# Altium project SIM_devkit.PrjPcb
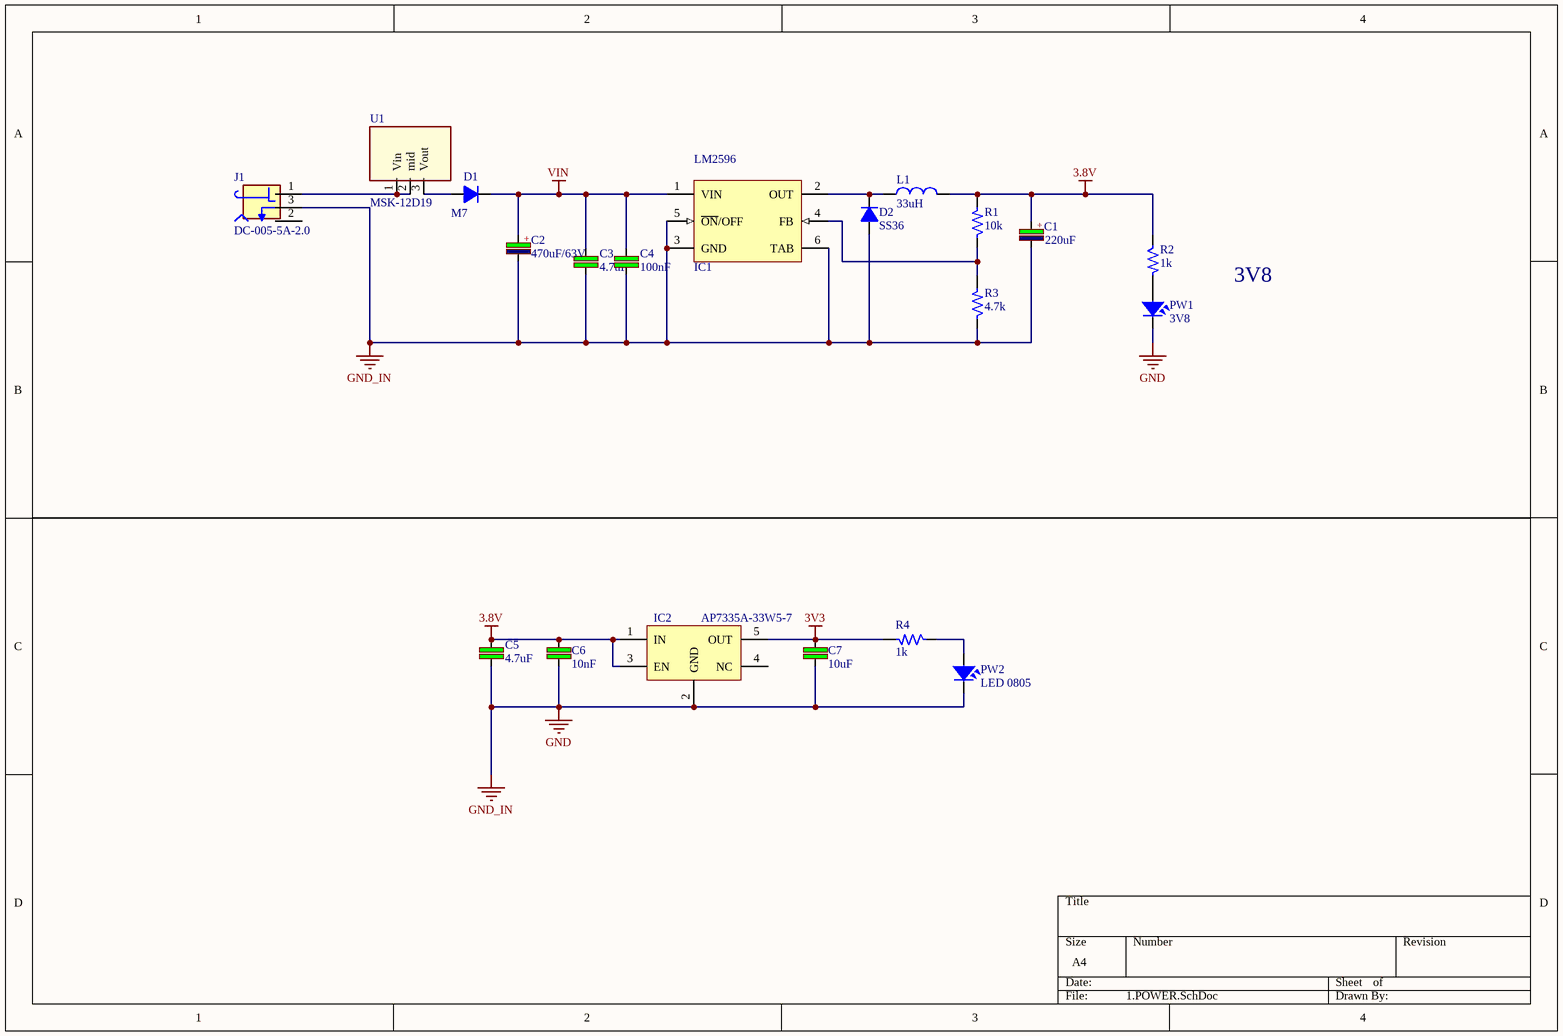
[diagram p0: 1.POWER.SchDoc]
4 sheets, 105 parts. Net scope: flat (ports and power ports of the same name join across sheets).
Board file: SIM.PcbDoc
Sheets:
  1.POWER.SchDoc
  2.4G.SchDoc
  4.STM32.SchDoc
  5.RS485.SchDoc

## Sheet 1.POWER.SchDoc
size A4; SheetNumber: 2; SheetTotal: 5

### Parts
C1  220uF  [EEFSDE]
C2  470uF/63V  [CAP-ALU-SMD-C]
C3  4.7uF  [C-0805]
C4  value 100nF  [C-0805]  (hidden comment: 4.7uF)
C5  4.7uF  [C-0805]
C6  10nF  [C-0805]
C7  10uF  [C-0805]
D1  M7  [LED-0805-Blue]
D2  SS36  [LED-0805-Blue]
IC1  LM2596  [TO-263]
IC2  AP7335A-33W5-7  [SOT23-5]
J1  DC-005-5A-2.0  [XKB_DC-005-5A-2.0]
L1  33uH  [Inductor_SMD]
PW1  3V8  [LED-0805-Blue]
PW2  LED 0805  [LED-0805-Blue]
R1  10k  [R-0805]
R2  1k  [R-0805]
R3  4.7k  [R-0805]
R4  1k  [R-0805]
U1  MSK-12D19  [Switch]

### Nets
3.8V: C1.1 C5.2 C6.1 IC2.1(IN) IC2.3(EN) L1.2 R1.2 R2.1
3V3: C7.1 IC2.5(OUT) R4.2
GND: C1.2 C2.2 C3.1 C4.1 C5.1 C6.2 C7.2 D2.1(A) IC1.3(GND) IC1.5(~{ON}/OFF) IC1.6(TAB) IC2.2(GND) J1.3 PW1.2 PW2.2 R3.1  [also labelled GND_IN]
VIN: C2.1 C3.2 C4.2 D1.2(K) IC1.1(VIN)
NetD1_1: D1.1(A) U1.3(Vout)
NetD2_2: D2.2(K) IC1.2(OUT) L1.1
NetIC1_4: IC1.4(FB) R1.1 R3.2
NetJ1_1: J1.1 U1.1(Vin) U1.2(mid)
NetPW1_1: PW1.1 R2.2
NetPW2_1: PW2.1 R4.1

Not connected (* = marked no-connect by the designer): IC2 4(NC); J1 2

### Notes on the sheet
- 3V8
- (in symbol CP3) +
- (in symbol CP5) +

### Library data of the parts
C1 = CP5: 220µF Molded Tantalum Polymer Capacitor 16V 2917 (7343 Metric) 40mOhm @ 100kHz; Manufacturer: AVX Corporation; Part number: TCME227M016R0040E; User_Description: CAP TANT POLY 220UF 16V 2917; Value: 220uF; Category: CAPACITOR; Package: 2917
C2 = CP3: Cap 470uF/63V; Value: Cap 470uF/63V
C3-C5 = C: 4.7µF ±10% 35V Ceramic Capacitor X5R 0805 (2012 Metric); Manufacturer: Samsung Electro-Mechanics; Part number: CL21A475KLCLQNC; User_Description: CAP CER 4.7UF 35V X5R 0805; Category: CAPACITOR; Package: 0805
  C3 C5: Value: 4.7uF
C6 = C: Cap SMD; Manufacturer: Samsung Electro-Mechanics; Part number: CL21A106KPFNNNG; Value: 10uF; User_Description: CAP CER 10UF 10V X5R 0805; Category: CAPACITOR; Package: 0805
C7 = C: Cap SMD; Manufacturer: Samsung Electro-Mechanics; Part number: CL21A106KPFNNNG; User_Description: CAP CER 10UF 10V X5R 0805; Value: 10uF; Category: CAPACITOR; Package: 0805
D1 = D1A: Diode 1A; Value: 1N4007
D2 = B340A: Diode Schottky 40V 3A Surface Mount DO-214AC (SMA); Manufacturer: Vishay General Semiconductor - Diodes Division; Part number: B340A-M3/61T; User_Description: DIODE SCHOTTKY 40V 3A DO214AC; Value: 40V 3A; Category: DIODE; Package: DO214AC
IC1 = LM2576
J1 = DC-005-5A-2.0: DC Power Receptacle Jack, Through Holeï¼ŒRight Angle; MF: XKB Industrial Precision; SnapEDA_Link: https://www.snapeda.com/parts/DC-005-5A-2.0/XKB+Industrial+Precision/view-part/?ref=snap; Package: Package; Value: *; MP: DC-005-5A-2.0; Check_prices: https://www.snapeda.com/parts/DC-005-5A-2.0/XKB+Industrial+Precision/view-part/?ref=eda
L1 = L1: 22µH Shielded Inductor 1.65A 96mOhm Max Nonstandard; Manufacturer: Bourns Inc.; Part Number: SRR0745A-220M; Value: 220uH; User_Description: FIXED IND 22UH 1.65A 96 MOHM SMD; Category: INDUCTORS; Package: SMD
PW1 PW2 = LED: LED RED DIFFUSED 0805 SMD; Manufacturer: OSRAM Opto Semiconductors Inc.; Part number: LS R976-NR-1; Value: Red; Category: LED SMD; Package: 0805; User_Description: LED RED DIFFUSED 0805 SMD
R1 = R: RES SMD 10K OHM 1% 1/8W 0805; Manufacturer: Yageo; Part number: RC0805FR-0710KL; Category: RESISTORS; Package: 0805; User_Description: RES SMD 10K OHM 1% 1/8W 0805; Value: 10k
R2 R4 = R: Resistor 1/4W; Manufacturer: Yageo; Part number: RC0805FR-071KL; User_Description: RES SMD 1K OHM 1% 1/8W 0805; Value: 1k; Category: RESISTORS; Package: 0805
R3 = R: RES SMD 3.3K OHM 1% 1/8W 0805; Manufacturer: Yageo; Part number: RC0805FR-073K3L; Category: RESISTORS; Package: 0805; User_Description: RES SMD 3.3K OHM 1% 1/8W 0805; Value: 3.3k
U1 = switch
IC2 = AP7335A-33W5-7: Package: SOT23-5; Part number: AP7335A-33W5-7

## Sheet 2.4G.SchDoc
size A3; SheetNumber: 3; SheetTotal: 5
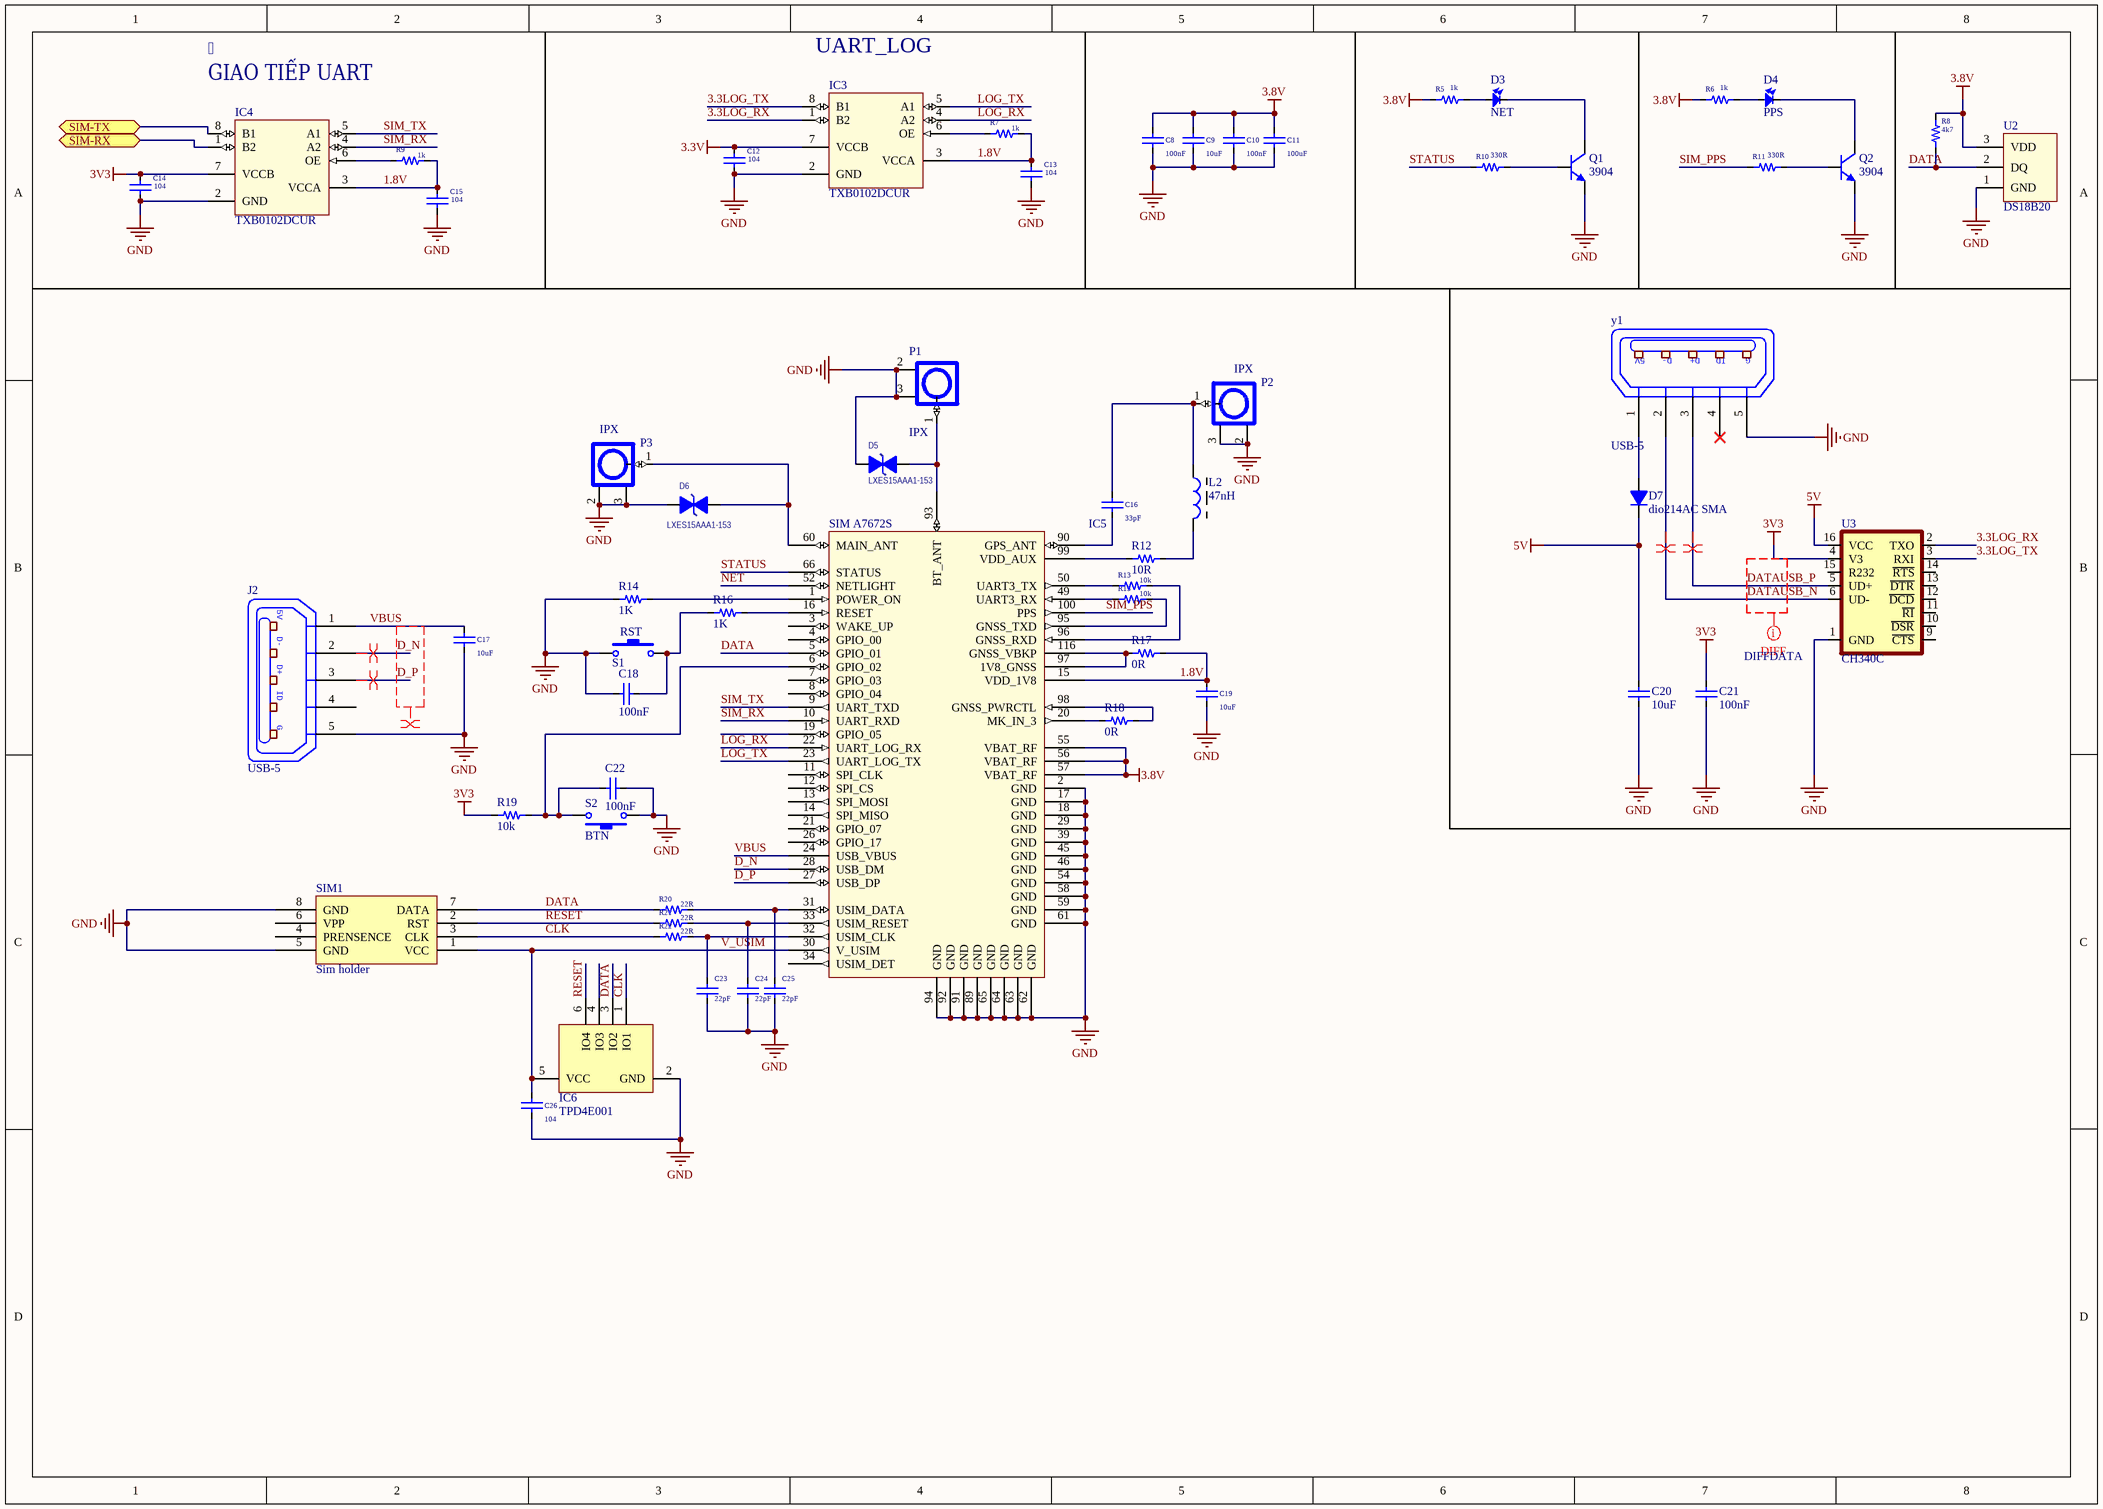
[diagram p1: 2.4G.SchDoc]

### Parts
C8  100nF  [CAP_0805]
C9  10uF  [CAP_0805]
C10  100nF  [CAP_0805]
C11  100uF  [CAP_0805]
C12  104  [CAP_0805]
C13  104  [CAP_0805]
C14  104  [CAP_0805]
C15  104  [CAP_0805]
C16  33pF  [CAP_0805]
C17  10uF  [CAP_0603]
C18  100nF  [CAP_0805]
C19  10uF  [CAP_0805]
C20  10uF  [CAP_0805]
C21  100nF  [CAP_0402]
C22  100nF  [CAP_0805]
C23  22pF  [CAP_0805]
C24  22pF  [CAP_0805]
C25  22pF  [CAP_0805]
C26  104  [CAP_0805]
D3  NET  [LED-0805-Blue]
D4  PPS  [LED-0805-Blue]
D5  LXES15AAA1-153  [INDC1005X45]
D6  LXES15AAA1-153  [INDC1005X45]
D7  dio214AC SMA  [DIO-SMD-106]
IC3  TXB0102DCUR  [SOP50P310X90-8N]
IC4  TXB0102DCUR  [SOP50P310X90-8N]
IC5  SIM A7672S  [A7672S]
IC6  TPD4E001  [SOT23-6]
J2  USB-5  [USB-M1]
L2  47nH  [Inductor_SMD]
P1  IPX  [IPXS]
P2  IPX  [IPXS]
P3  IPX  [IPXS]
Q1  3904  [MMBT3904]
Q2  3904  [MMBT3904]
R5  1k  [RES-SMD-0805]
R6  1k  [RES-SMD-0805]
R7  1k  [RES-SMD-0805]
R8  4k7  [RES-SMD-0805]
R9  1k  [RES-SMD-0805]
R10  330R  [RES-SMD-0805]
R11  330R  [RES-SMD-0805]
R12  10R  [RES-SMD-0805]
R13  10k  [RES-SMD-0805]
R14  1K  [RES-SMD-0805]
R15  10k  [RES-SMD-0805]
R16  1K  [RES-SMD-0805]
R17  0R  [RES-SMD-0805]
R18  0R  [RES-SMD-0805]
R19  10k  [RES-SMD-0805]
R20  22R  [RES-SMD-0805]
R21  22R  [RES-SMD-0805]
R22  22R  [RES-SMD-0805]
S1  RST  [SW-SMD]
S2  BTN  [SW-SMD]
SIM1  Sim holder  [SIM_MicroSIM 6P Flip]
U2  DS18B20  [QTO-92A]
U3  CH340C  [SOP-16]
y1  USB-5  [USB-M1]

### Ports
SIM-RX (bidir), SIM-TX (bidir)

### Nets
3.3V: C12.2 IC3.7(VCCB)
3.8V: C8.2 C9.2 C10.2 C11.2 IC5.55(VBAT_RF) IC5.56(VBAT_RF) IC5.57(VBAT_RF) R5.2 R6.2 R8.1 U2.3(VDD)
3V3: C14.2 C21.1 IC4.7(VCCB) R19.1 U3.4(V3)
5V: C20.1 D7.2(K) U3.16(VCC)
GND: C8.1 C9.1 C10.1 C11.1 C12.1 C13.1 C14.1 C15.1 C17.1 C18.1 C19.1 C20.2 C21.2 C22.2 C23.1 C24.1 C25.1 C26.1 D5.2(K) D6.2(K) IC3.2(GND) IC4.2(GND) IC5.2(GND) IC5.17(GND) IC5.18(GND) IC5.29(KEYPAD_0) IC5.39(GND) IC5.45(GND) IC5.46(ADC2) IC5.54(GPIO4) IC5.58(GND) IC5.59(GND) IC5.61(GND) IC5.62(GND) IC5.63(GND) IC5.64(GND) IC5.65(GND) IC5.89(GND) IC5.91(GND) IC5.92(GND) IC5.94(GND) IC6.2(GND) J2.5(P5) P1.2 P1.3 P2.2 P2.3 P3.2 P3.3 Q1.2(E) Q2.2(E) R14.1 S1.1 S2.1 SIM1.5(GND) SIM1.8(GND) U2.1(GND) U3.1(GND) y1.5(P5)
1.8V: C13.2 C15.2 C19.2 IC3.3(VCCA) IC4.3(VCCA) IC5.15(RESERVED) R7.1 R9.1 R17.2
3.3LOG_RX: IC3.1(B2) U3.2(TXO)
3.3LOG_TX: IC3.8(B1) U3.3(RXI)
CLK: IC6.1(IO1) R22.2 SIM1.3(CLK)
D_N: IC5.28(KEYSENSE_N0) J2.2(P2)
D_P: IC5.27(KEYSENSE_N1) J2.3(P3)
DATA: IC5.5(GPIO_01) IC6.3(IO2) R8.2 R20.2 SIM1.7(DATA) U2.2(DQ)
DATAUSB_N: U3.6(UD-) y1.2(P2)
DATAUSB_P: U3.5(UD+) y1.3(P3)
LOG_RX: IC3.4(A2) IC5.22(SPK_P)
LOG_TX: IC3.5(A1) IC5.23(MIC1P)
NET: IC5.52(GPIO41)
RESET: IC6.6(IO4) R21.2 SIM1.2(RST)
SIM_PPS: IC5.100(PPS) R11.2
SIM_RX: IC4.4(A2) IC5.10(UART_RXD)
SIM_TX: IC4.5(A1) IC5.9(UART_TXD)
STATUS: IC5.66(STATUS) R10.2
V_USIM: C26.2 IC5.30(KEYPAD_2) IC6.5(VCC) SIM1.1(VCC)
VBUS: C17.2 IC5.24(MIC1N) J2.1(P1)
NetC16_1: C16.1 IC5.90(GPS_ANT)
NetC16_2: C16.2 L2.1 P2.1
NetC18_2: C18.2 R16.1 S1.2
NetC22_1: C22.1 IC5.6(GPIO_02) R19.2 S2.2
NetC23_2: C23.2 IC5.32(KEYSENSE_N3) R22.1
NetC24_2: C24.2 IC5.33(KEYPAD_1) R21.1
NetC25_2: C25.2 IC5.31(KEYSENSE_N2) R20.1
NetD3_1: D3.1 R5.1
NetD3_2: D3.2 Q1.3(C)
NetD4_1: D4.1 R6.1
NetD4_2: D4.2 Q2.3(C)
NetD5_1: D5.1(A) IC5.93(BT_ANT) P1.1
NetD6_1: D6.1(A) IC5.60(MAIN_ANT) P3.1
NetD7_1: D7.1(A) y1.1(P1)
NetIC3_6: IC3.6(OE) R7.2
NetIC4_1: IC4.1(B2) ; port SIM-RX
NetIC4_6: IC4.6(OE) R9.2
NetIC4_8: IC4.8(B1) ; port SIM-TX
NetIC5_1: IC5.1(POWER_ON) R14.2
NetIC5_16: IC5.16(RESERVED) R16.2
NetIC5_20: IC5.20(MK_IN_3) R18.1
NetIC5_49: IC5.49(GPIO40) R15.2
NetIC5_50: IC5.50(GPIO43) R13.2
NetIC5_95: IC5.95(GNSS_TXD) R15.1
NetIC5_96: IC5.96(GNSS_RXD) R13.1
NetIC5_97: IC5.97(1V8_GNSS) IC5.116(GNSS_VBKP) R17.1
NetIC5_98: IC5.98(GNSS_PWRCTL) R18.2
NetIC5_99: IC5.99(VDD_AUX) R12.1
NetL2_2: L2.2 R12.2
NetQ1_1: Q1.1(B) R10.1
NetQ2_1: Q2.1(B) R11.1

Not connected (* = marked no-connect by the designer): IC5 3(WAKE_UP) 4(GPIO_00) 7(GPIO_03) 8(GPIO_04) 11(SPI_CLK) 12(SPI_CS) 13(SPI_MOSI) 14(SPI_MISO) 19(GPIO_05) 21(SPK_M) 25(EAR1N) 26(EAR1P) 34(KEYPAD_4) 35(KEYPAD_3) 36(KEYSENSE_N4) 47(ADC1) 48(GPIO44) 51(GPIO1) 53(GPIO42) 73(PCM_DOUT) 74(PCM_DIN) 75(PCM_SYNC) 76(PCM_CLK); IC6 4(IO3); J2 4(P4); SIM1 4(PRENSENCE) 6(VPP); U3 9(~{CTS}) 10(~{DSR}) 11(~{RI}) 12(~{DCD}) 13(~{DTR}) 14(~{RTS}) 15(R232); y1 4(P4)*

### Layout directives
net class DIFFDATA: DATAUSB_N, DATAUSB_P
differential pair; net class DIFFDATA: D_N, D_P, DATAUSB_N, DATAUSB_P

### Notes on the sheet
- 
- (near IC4) GIAO TIẾP UART
- (near IC3) UART_LOG
- (in symbol USB-5) 5V; D-; D+; ID; G

### Library data of the parts
C8-C26 = CapSMD: Capacitor; Value: 33p; Published: 8-Jun-2000; LatestRevisionDate: 17-Jul-2002; LatestRevisionNote: Re-released for DXP Platform.; PackageReference: RAD-0.3; Publisher: Altium Limited
D3 D4 = LED: LED Single colour Green and Red; Value: LED 3 ly Single Colour
D5 D6 = TVS: TVS DIODE 4VWM 1005; Manufacturer: Murata Electronics; Value: 4V; Category: Circuit Protection; Package: 0402; Part number: LXES15AAA1-153; User_Description: TVS DIODE 4VWM 1005
D7 = D1A: Diode 1A; Value: 1N4007
IC3 IC4 = TXB0102DCUR: IC TRNSLTR BIDIRECTIONAL US8; Manufacturer: Texas Instruments; Category: IC Logic Level; Package: 8-VSSOP; Part number: TXB0102DCUR; User_Description: IC TRNSLTR BIDIRECTIONAL US8
IC5 = SIM A7672S: SIM A7672S-CAT-M1; Part number: SIM A7672S
IC6 = TPD4E001_1: Manufacturer: Texas Instruments; Part number: TPD4E001RDBVR; User_Description: TVS DIODE 5.5VWM SC70-6; Category: Circuit Protection; Package: SOT-363
J2 y1 = USB-5: Manufacturer: FCI; Category: Connectors, Interconnects
L2 = Inductor Ferit: FIXED IND 47NH 300MA 700MOHM SMD; Manufacturer: Taiyo Yuden; Part number: HK160847NJ-T; Value: 150 mH; Category: INDUCTORS; Package: 0603; User_Description: FIXED IND 47NH 300MA 700MOHM SMD
P1-P3 = IPXSx66: Antenna GSM GPS; Manufacturer: TE Connectivity AMP Connectors; Part number: 2334884-1; User_Description: UMCC MICRO-COAX RECEPTACLE, GEN; Category: Connectors; Package: SMD
Q1 Q2 = MMBT3904
R5-R22 = Resistor - SMD: Resistor; Manufacturer: Generic Components; Class: Passive; Published: 08/06/2000; Publisher: Altium Hobart Technology Centre
S1 S2 = SW-SMD: Switch; Published: 24-Mar-1999; LatestRevisionDate: 17-Jul-2002; LatestRevisionNote: Re-released for DXP Platform.; PackageReference: SPST-2; Publisher: Altium Limited
SIM1 = SIM_MicroSim
U2 = DS18B20: High Precision  1-Wire® Digital Thermometer
U3 = CH340C: USB to serial chip CH340; MF: WCH; Package: Package; Check_prices: https://www.snapeda.com/parts/CH340C/WCH/view-part/5428851/?ref=eda; Value: *; Price: None; MP: CH340C; Availability: Unavailable; SnapEDA_Link: https://www.snapeda.com/parts/CH340C/WCH/view-part/5428851/?ref=snap

## Sheet 4.STM32.SchDoc
size A3; SheetNumber: 4; SheetTotal: 5
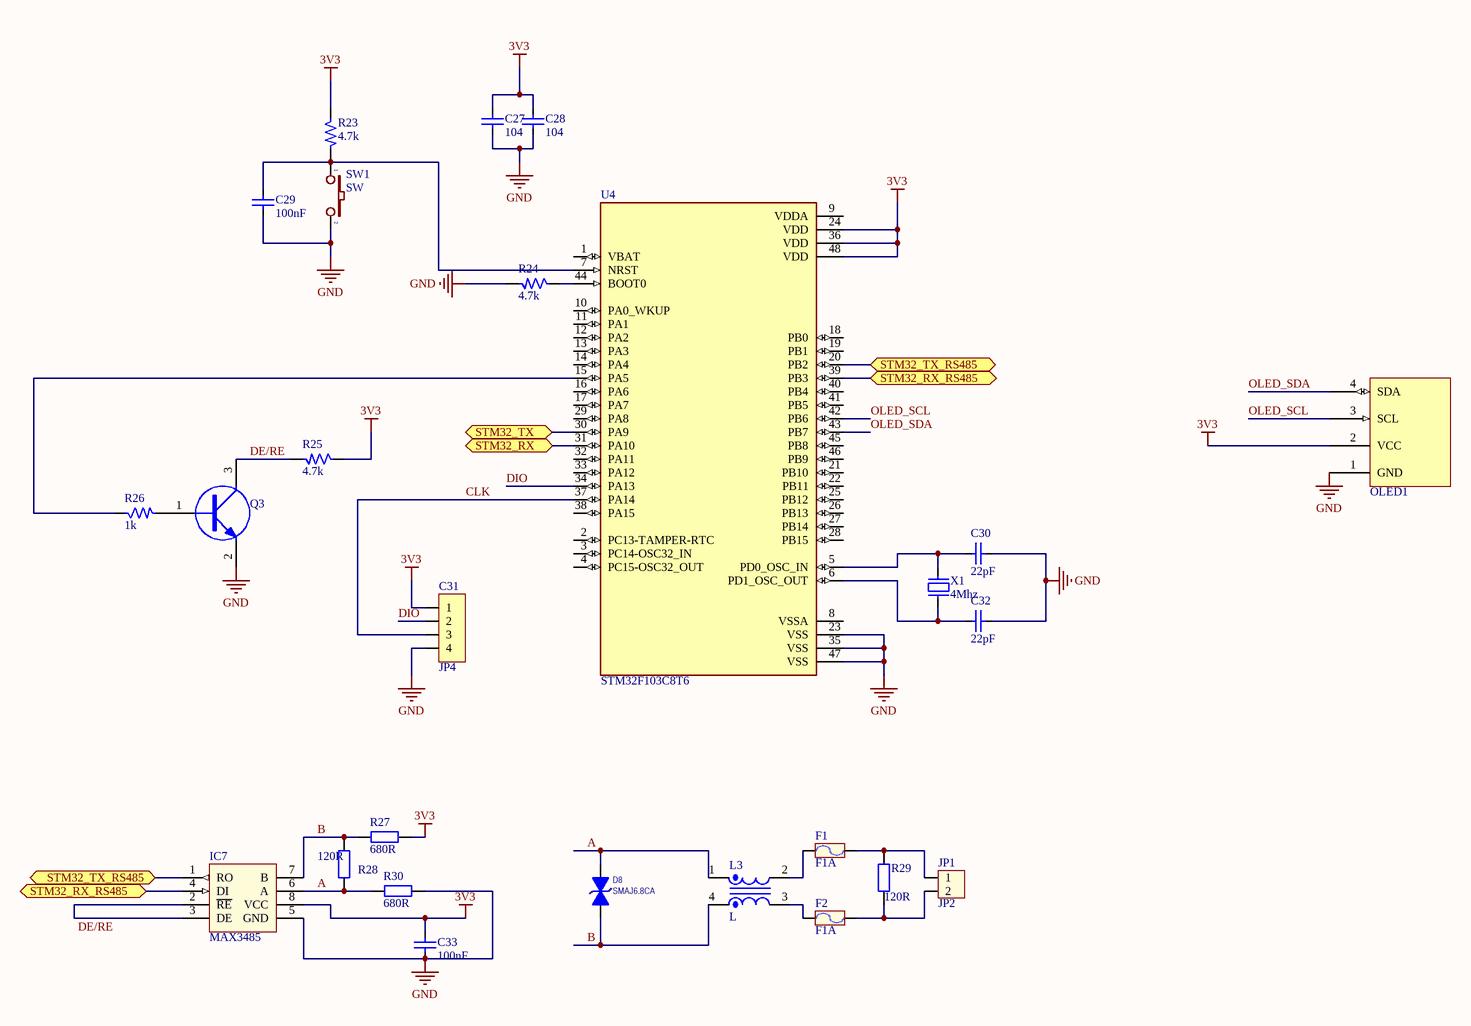
[diagram p2: 4.STM32.SchDoc]

### Parts
C27  104  [CAP_0805]
C28  104  [CAP_0805]
C29  100nF  [CAP_0805]
C30  22pF  [CAP_0805]
C31  JP4  [JP4-C1T]
C32  22pF  [CAP_0805]
C33  100nF  [CAP_0805]
D8  SMAJ6.8CA  [SOD323 - DO241]
F1  F1A  [RES-SMD-1206]
F2  F1A  [RES-SMD-1206]
IC7  MAX3485  [SOIC-8]
JP1  JP2  [KF2-5.08]
L3  L  [L-B82793S0513N201]
OLED1  SSD1306  [OLED 1.3]  (value not drawn)
Q3  C1815(MMBT4401)  [SOT23]  (value not drawn)
R23  4.7k  [R-0805]
R24  4.7k  [R-0805]
R25  4.7k  [R-0805]
R26  1k  [R-0805]
R27  680R  [RES-SMD-0805]
R28  120R  [RES-SMD-0805]
R29  120R  [RES-SMD-0805]
R30  680R  [RES-SMD-0805]
SW1  SW  [SW2]
U4  STM32F103C8T6  [STM32F103C8T6]
X1  4Mhz  [XT2]

### Ports
STM32_RX (bidir), STM32_RX_RS485 (bidir), STM32_TX (bidir), STM32_TX_RS485 (bidir)

### Nets
3V3: C27.1 C28.1 C31.1 C33.1 IC7.8(VCC) OLED1.2(VCC) R23.1 R25.1 R27.2 U4.24(VDD) U4.36(VDD) U4.48(VDD)
GND: C27.2 C28.2 C29.2 C30.1 C31.4 C32.1 C33.2 IC7.5(GND) OLED1.1(GND) Q3.2(E) R24.2 R30.2 SW1.2 U4.23(VSS) U4.35(VSS) U4.47(VSS)
A: D8.2(K) IC7.6(A) L3.1 R28.2 R30.1
B: D8.1(A) IC7.7(B) L3.4 R27.1 R28.1
CLK: C31.3 U4.37(PA14)
DE/RE: IC7.2(~{RE}) IC7.3(DE) Q3.3(C) R25.2
DIO: C31.2 U4.34(PA13)
OLED_SCL: OLED1.3(SCL) U4.42(PB6)
OLED_SDA: OLED1.4(SDA) U4.43(PB7)
NetC29_1: C29.1 R23.2 SW1.1 U4.7(NRST)
NetC30_2: C30.2 U4.5(PD0_OSC_IN) X1.2
NetC32_2: C32.2 U4.6(PD1_OSC_OUT) X1.1
NetF1_1: F1.1 L3.2
NetF1_2: F1.2 JP1.1 R29.1
NetF2_1: F2.1 L3.3
NetF2_2: F2.2 JP1.2 R29.2
NetIC7_1: IC7.1(RO) U4.20(PB2) ; port STM32_TX_RS485
NetIC7_4: IC7.4(DI) U4.39(PB3) ; port STM32_RX_RS485
NetQ3_1: Q3.1(B) R26.2
NetR24_1: R24.1 U4.44(BOOT0)
NetR26_1: R26.1 U4.15(PA5)
NetU4_30: U4.30(PA9) ; port STM32_TX
NetU4_31: U4.31(PA10) ; port STM32_RX

Not connected (* = marked no-connect by the designer): U4 1(VBAT) 2(PC13-TAMPER-RTC) 3(PC14-OSC32_IN) 4(PC15-OSC32_OUT) 8(VSSA) 9(VDDA) 10(PA0_WKUP) 11(PA1) 12(PA2) 13(PA3) 14(PA4) 16(PA6) 17(PA7) 18(PB0) 19(PB1) 21(PB10) 22(PB11) 25(PB12) 26(PB13) 27(PB14) 28(PB15) 29(PA8) 32(PA11) 33(PA12) 38(PA15) 40(PB4) 41(PB5) 45(PB8) 46(PB9)

### Library data of the parts
C27-C30 C32 C33 = CapSMD: Capacitor; Value: 33p; Published: 8-Jun-2000; LatestRevisionDate: 17-Jul-2002; LatestRevisionNote: Re-released for DXP Platform.; PackageReference: RAD-0.3; Publisher: Altium Limited
C31 = JP4: WR-PHD 2.54 mm Angled Socket Header; Manufacturer: W¨¹rth Elektronik eiSos GmbH; partNo: 613004143121; ComponentLink1 Description: Manufacturer; ComponentLink2 Description: Datasheet; NoPins: 04; Created Date: 29 March 2013; ComponentLink1URL: http://www.we-online.com; ComponentLink2URL: http://katalog.we-online.de/em/datasheet/6130xx143121.pdf; Created by: Karrer Zheng
D8 = SMAJ30CA-30V/8.3A: TVS DIODE 30VWM 48.4VC SMA; Manufacturer: Bourns Inc.; Part number: PSD12C; Category: Circuit Protection; Package: SOD323; User_Description: TVS DIODE 30VWM 48.4VC SMA
F1 F2 = Fuse: F smd1206 0.315A; Value: Fuse; Designed by: VanDungEvn
IC7 = MAX3362EKA+T: IC TRANSCEIVER HALF 1/1 SOT23-8; Manufacturer: Maxim Integrated; Category: Interface - Drivers; Package: SOT-23-8; User_Description: IC TRANSCEIVER HALF 1/1 SOT23-8; Part number: MAX3362EKA+T
JP1 = Con2: Connector 2; Value: Connector 2
L3 = L filter Common Mode Chokes: CMC 51UH 800MA 2LN SMD AEC-Q200; Manufacturer: EPCOS - TDK Electronics; Part number: B82793S0513N201; User_Description: CMC 51UH 800MA 2LN SMD AEC-Q200
OLED1 = OLED 1.3": OLED 1.3" SSD1306
Q3 = NPN: Transistor C1815, SOT23; Manufacturer: Fairchild Semiconductor; User_Description: 0.6A, 40V, NPN; Category: TRAN NPN; Package: SOT-23; Part number: MMBT4401
R23-R25 = R: RES SMD 4.7K OHM 1% 1/8W 0805; Manufacturer: Yageo; Part number: RC0805FR-074K7L; Category: RESISTORS; Package: 0805; User_Description: RES SMD 4.7K OHM 1% 1/8W 0805; Value: 4.7k
R26 = R: as R2 on sheet 1.POWER; Category: RESISTORS; Package: 0805; Value: 1k
R27-R30 = Resistor - SMD: Resistor SMD; Manufacturer: Generic Components; Class: Passive; Published: 08/06/2000; Publisher: Altium Hobart Technology Centre
SW1 = SW2: Switch button 2 pin; Value: SW chip 2 pin
U4 = STM32F103C8T6: Mainstream Performance line, ARM Cortex-M3 MCU with 64 Kbytes Flash, 72 MHz CPU, motor control, USB and CAN
X1 = XT2: Crystal For all Crystal 2pin.; Value: 4Mhz

## Sheet 5.RS485.SchDoc
size A3; SheetNumber: 5; SheetTotal: 5

## Nets that join several sheets
3.8V: 1.POWER (8 pins), 2.4G (11 pins)
3V3: 1.POWER (C7.1 IC2.5 R4.2), 2.4G (5 pins), 4.STM32 (12 pins)
GND: 1.POWER (16 pins), 2.4G (59 pins), 4.STM32 (16 pins)